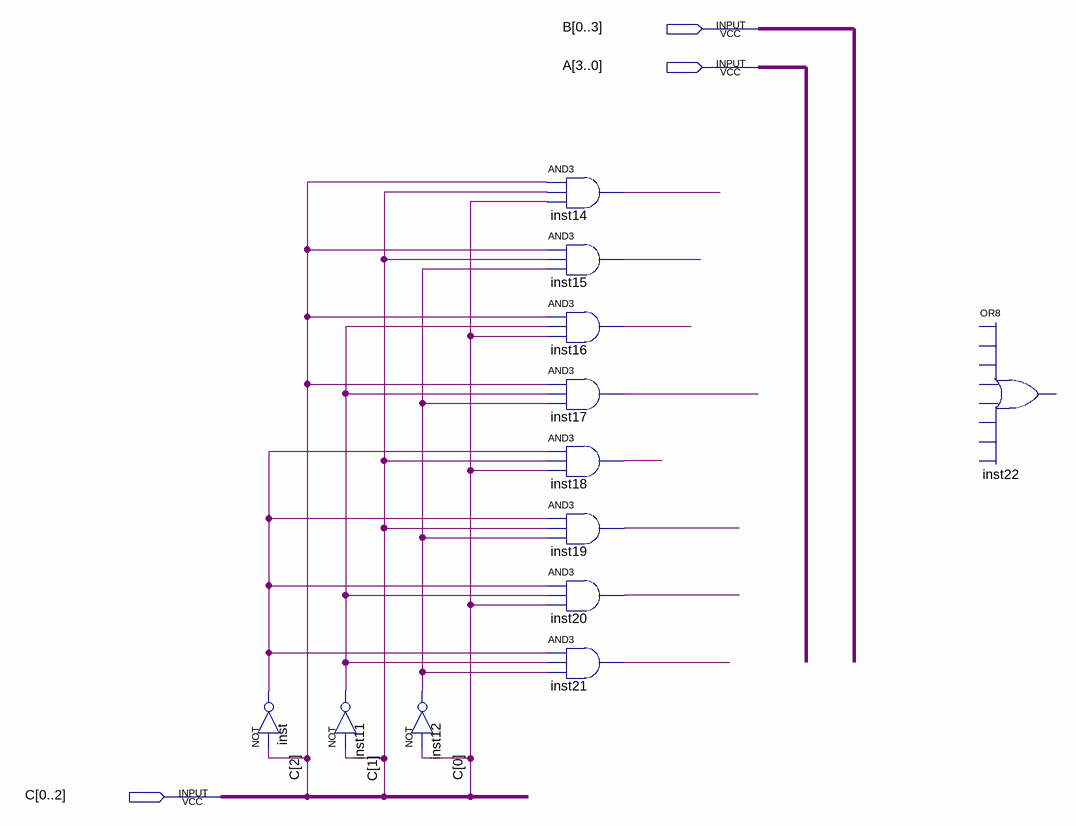
[diagram p0: schematic sheet]
// Quartus schematic Mux.bdf as structural Verilog: 12 symbols, 3 pins
module Mux (
  input  [0:3] B,
  input  [3:0] A,
  input  [0:2] C
);

  wire inst11_out, inst12_out, inst14_out, inst15_out, inst16_out, inst17_out, inst18_out, inst19_out,
       inst20_out, inst21_out, inst_out;

  not inst (inst_out, C[2]);
  not inst11 (inst11_out, C[1]);
  not inst12 (inst12_out, C[0]);
  and inst14 (inst14_out, C[2], C[1], C[0]);
  and inst15 (inst15_out, C[2], C[1], inst12_out);
  and inst16 (inst16_out, C[2], inst11_out, C[0]);
  and inst17 (inst17_out, C[2], inst11_out, inst12_out);
  and inst18 (inst18_out, inst_out, C[1], C[0]);
  and inst19 (inst19_out, inst_out, C[1], inst12_out);
  and inst20 (inst20_out, inst_out, inst11_out, C[0]);
  and inst21 (inst21_out, inst_out, inst11_out, inst12_out);
  // OR8 inst22 is placed but not wired
endmodule
